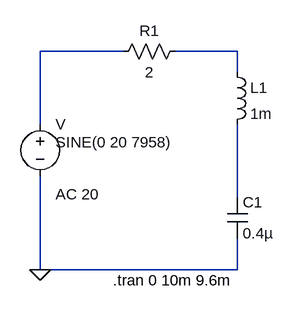
[diagram p0: schematic resonant_series.asc]
resonant_series.asc, the LTspice schematic file:
Version 4
SHEET 1 880 680
WIRE 144 112 16 112
WIRE 320 112 224 112
WIRE 320 144 320 112
WIRE 16 224 16 112
WIRE 320 336 320 224
WIRE 16 448 16 304
WIRE 320 448 320 400
WIRE 320 448 16 448
FLAG 16 448 0
SYMBOL res 128 128 R270
WINDOW 0 32 56 VTop 2
WINDOW 3 0 56 VBottom 2
SYMATTR InstName R1
SYMATTR Value 2
SYMBOL ind 304 128 R0
SYMATTR InstName L1
SYMATTR Value 1m
SYMBOL cap 304 336 R0
SYMATTR InstName C1
SYMATTR Value 0.4µ
SYMBOL voltage 16 208 R0
WINDOW 123 24 124 Left 2
WINDOW 39 0 0 Left 2
WINDOW 3 24 44 Left 2
SYMATTR Value2 AC 20
SYMATTR InstName V
SYMATTR Value SINE(0 20 7958)
TEXT 128 464 Left 2 !.tran 0 10m 9.6m

The netlist it stands for:
* resonant_series.asc
R1 N001 N002 2
L1 N002 N003 1m
C1 N003 0 0.4µ
V N001 0 SINE(0 20 7958) AC 20
.tran 0 10m 9.6m
.backanno
.end